# Altium schematic sheet USB INTERFACES.SchDoc
size A1; Organization: Protel International P/L; Address1: L3, 12a Rodborough Rd; Address2: Frenchs Forest; Address3: NSW; Address4: Australia 2086
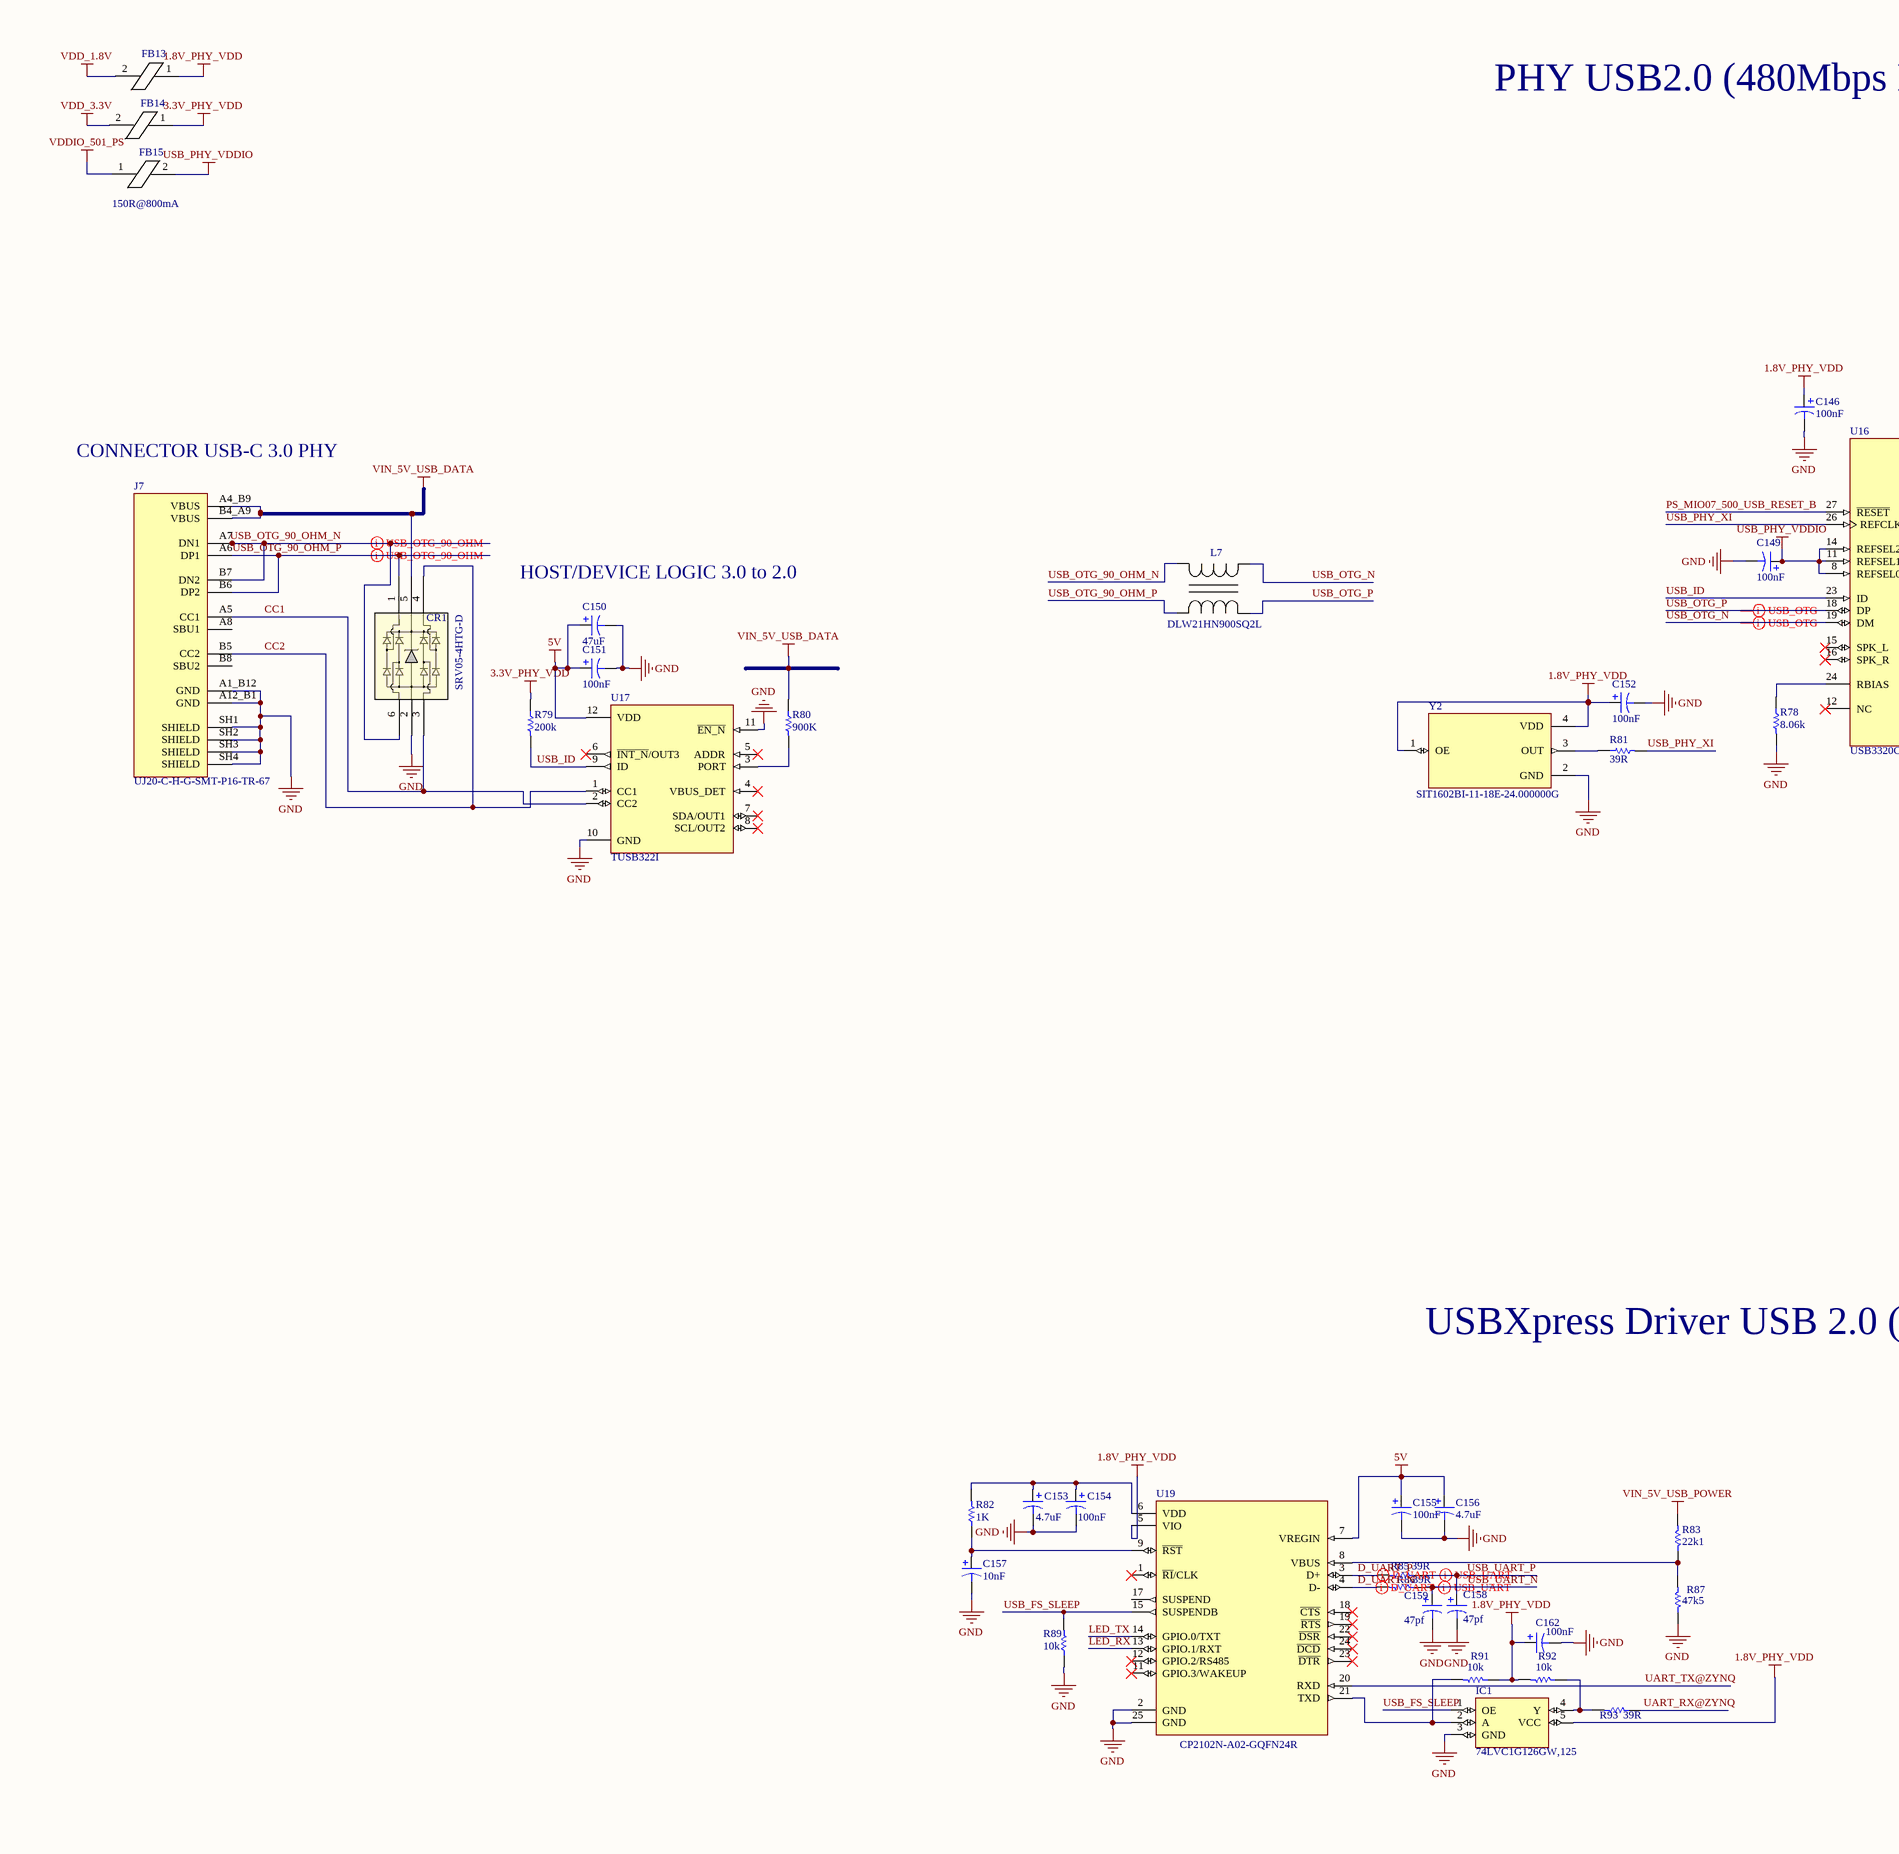
[diagram p0: USB INTERFACES.SchDoc, left]
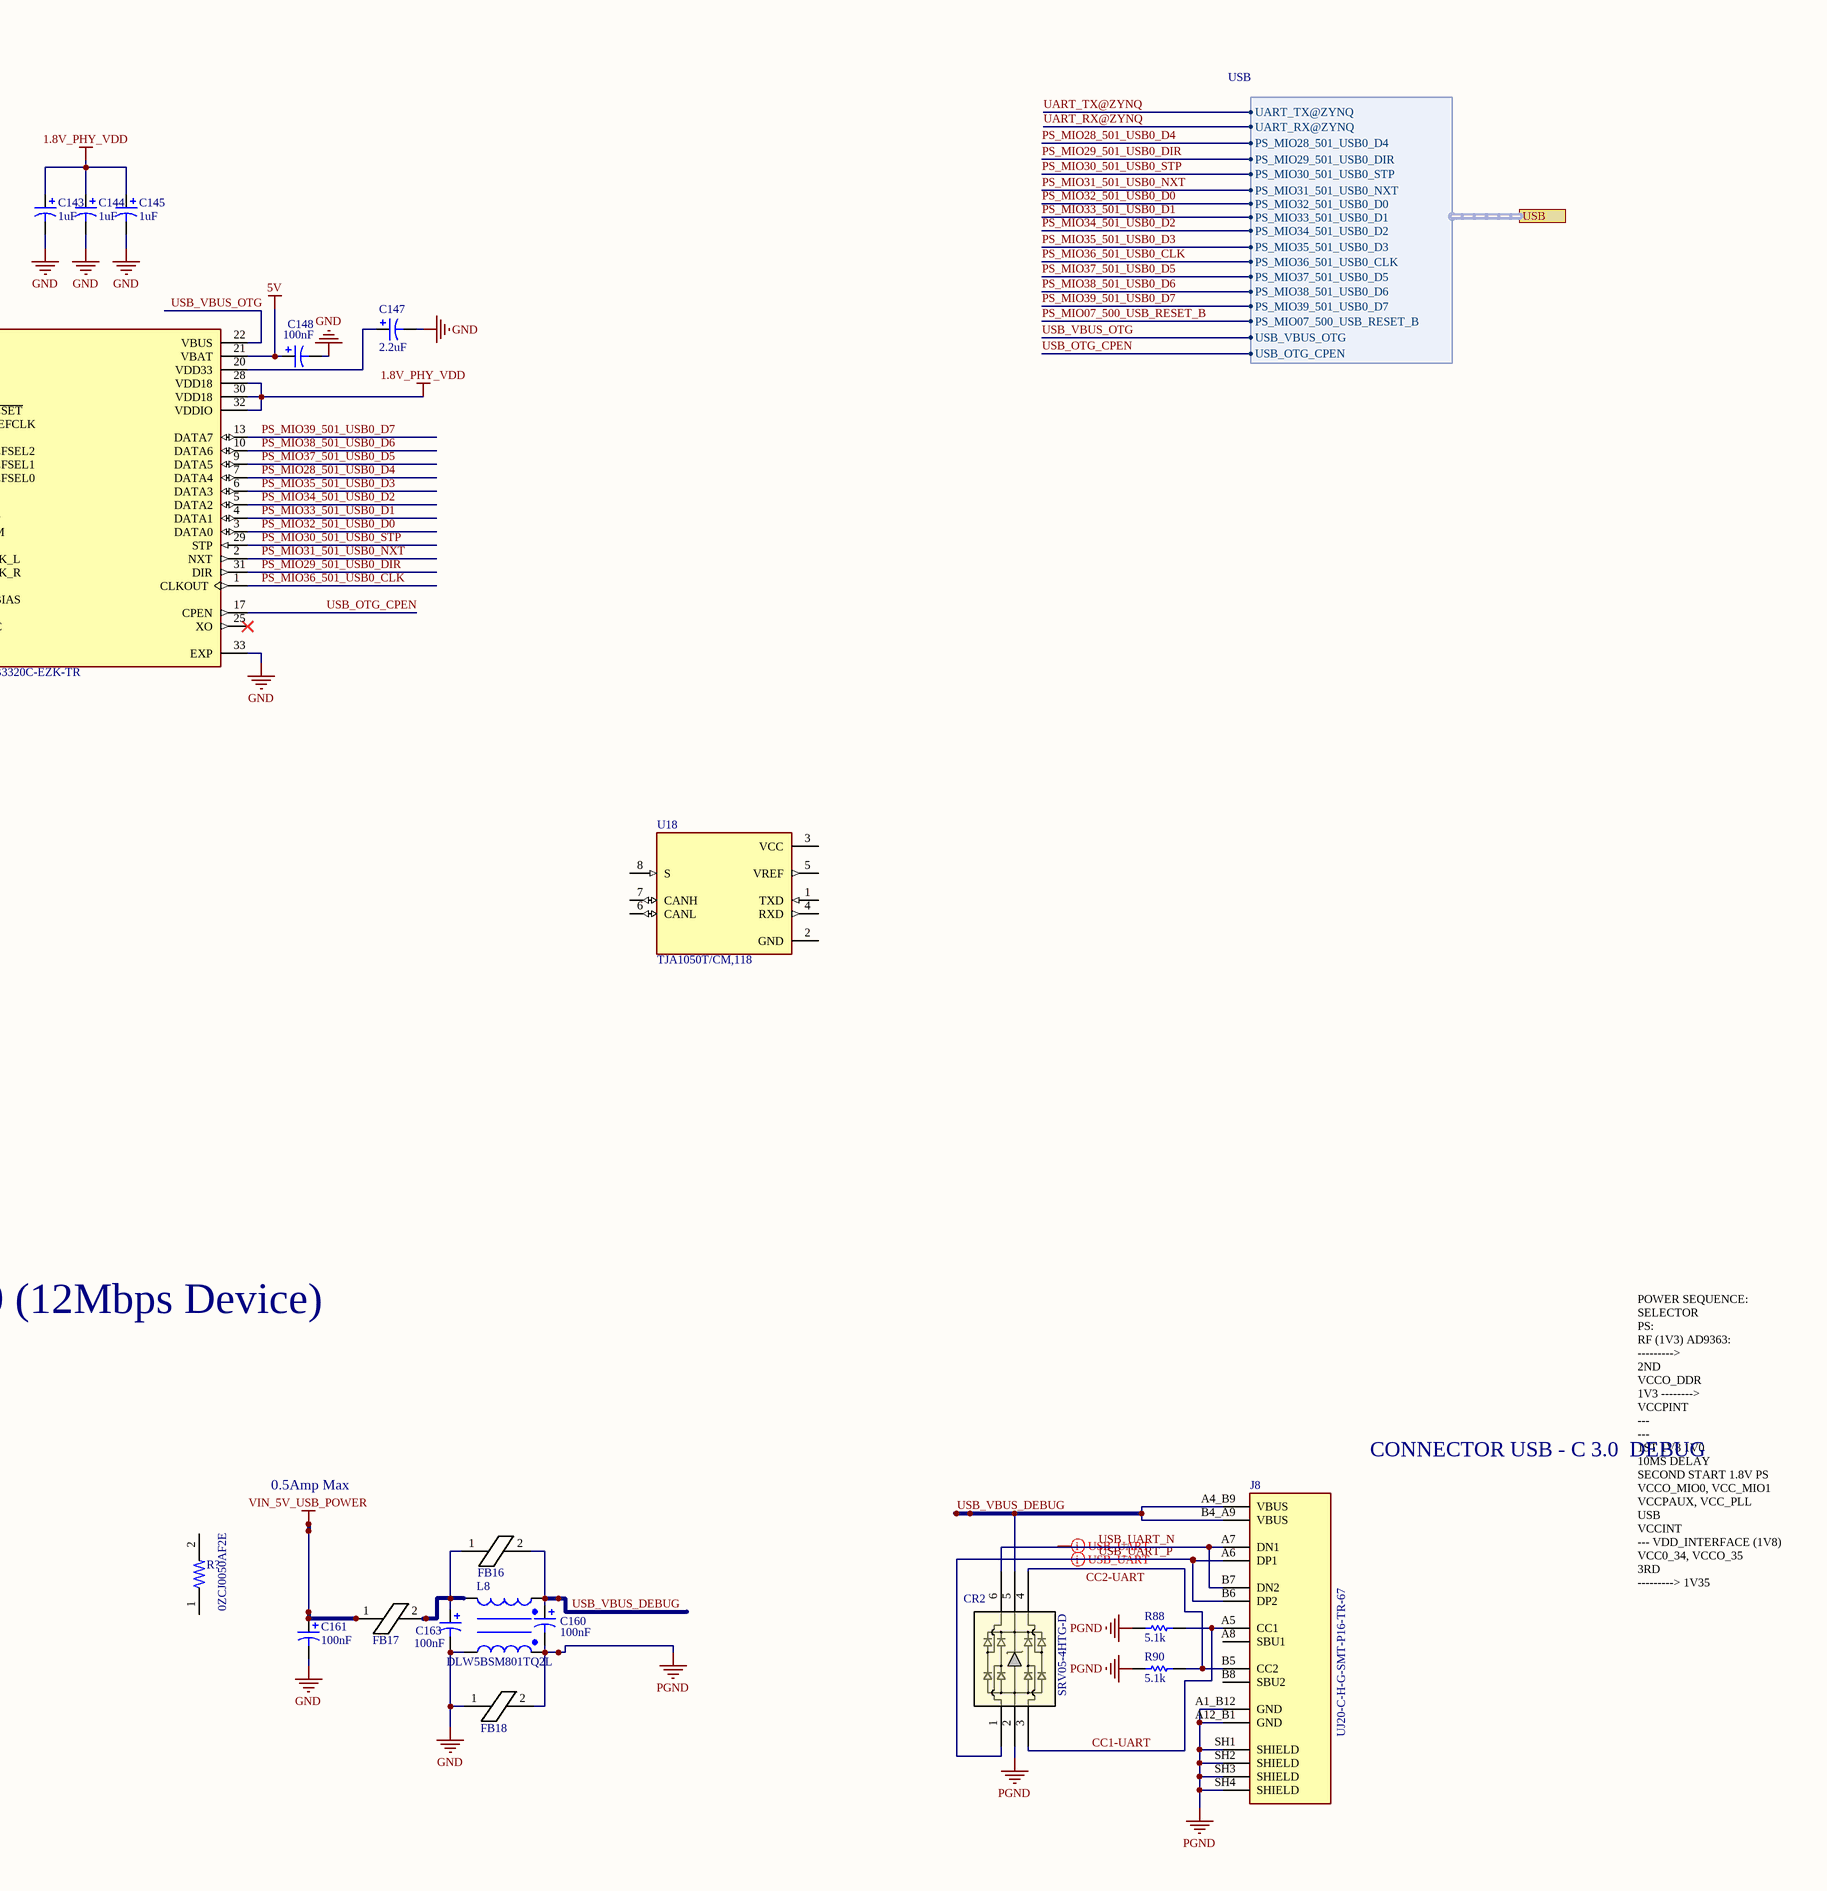
[diagram p1: USB INTERFACES.SchDoc, right]

## Parts
C143  value 1uF  [C0805]  (hidden comment: Cap Pol3)
C144  value 1uF  [C0805]  (hidden comment: Cap Pol3)
C145  value 1uF  [C0805]  (hidden comment: Cap Pol3)
C146  value 100nF  [C0805]  (hidden comment: Cap Pol3)
C147  value 2.2uF  [C0805]  (hidden comment: Cap Pol3)
C148  value 100nF  [C0805]  (hidden comment: Cap Pol3)
C149  value 100nF  [C0805]  (hidden comment: Cap Pol3)
C150  value 47uF  [C0805]  (hidden comment: Cap Pol3)
C151  value 100nF  [C0805]  (hidden comment: Cap Pol3)
C152  value 100nF  [C0805]  (hidden comment: Cap Pol3)
C153  value 4.7uF  [C0805]  (hidden comment: Cap Pol3)
C154  value 100nF  [C0805]  (hidden comment: Cap Pol3)
C155  value 100nF  [C0805]  (hidden comment: Cap Pol3)
C156  value 4.7uF  [C0805]  (hidden comment: Cap Pol3)
C157  value 10nF  [C0805]  (hidden comment: Cap Pol3)
C158  value 47pf  [C0805]  (hidden comment: Cap Pol3)
C159  value 47pf  [C0805]  (hidden comment: Cap Pol3)
C160  value 100nF  [C0805]  (hidden comment: Cap Pol3)
C161  value 100nF  [C0805]  (hidden comment: Cap Pol3)
C162  value 100nF  [C0805]  (hidden comment: Cap Pol3)
C163  value 100nF  [C0805]  (hidden comment: Cap Pol3)
CR1  SRV05-4HTG-D  [SOIC6_SOT23-6_CRA_LTF]
CR2  SRV05-4HTG-D  [SOIC6_SOT23-6_CRA_LTF]
FB13  FERRITA  [0805R]  (value not drawn)
FB14  FERRITA  [0805R]  (value not drawn)
FB15  FERRITA  [0805R]  (value not drawn)
FB16  FERRITA  [0805R]  (value not drawn)
FB17  FERRITA  [0805R]  (value not drawn)
FB18  FERRITA  [0805R]  (value not drawn)
IC1  74LVC1G126GW,125  [SOT65P212X110-5N]
J7  UJ20-C-H-G-SMT-P16-TR-67  [SAMESKY_UJ20-C-H-G-SMT-P16-TR-67]
J8  UJ20-C-H-G-SMT-P16-TR-67  [SAMESKY_UJ20-C-H-G-SMT-P16-TR-67]
L7  DLW21HN900SQ2L  [IND_DLW21H_0805_MUR]
L8  DLW5BSM801TQ2L  [FIL_DLW5BSM801TQ2L]
R78  value 8.06k  [0603]  (hidden comment: Res1)
R79  value 200k  [0603]  (hidden comment: Res1)
R80  value 900K  [0603]  (hidden comment: Res1)
R81  value 39R  [0603]  (hidden comment: Res1)
R82  value 1K  [0603]  (hidden comment: Res1)
R83  value 22k1  [0603]  (hidden comment: Res1)
R85  value 39R  [0603]  (hidden comment: Res1)
R86  value 39R  [0603]  (hidden comment: Res1)
R87  value 47k5  [0603]  (hidden comment: Res1)
R88  value 5.1k  [0603]  (hidden comment: Res1)
R89  value 10k  [0603]  (hidden comment: Res1)
R90  value 5.1k  [0603]  (hidden comment: Res1)
R91  value 10k  [0603]  (hidden comment: Res1)
R92  value 10k  [0603]  (hidden comment: Res1)
R93  value 39R  [0603]  (hidden comment: Res1)
R?  0ZCJ0050AF2E  [RESC3216X125N]
U16  USB3320C-EZK-TR  [QFN50P500X500X100-33N]
U17  TUSB322I  [IC_TUSB320IRWBR]
U18  TJA1050T/CM,118  [SOIC127P600X175-8N]
U19  CP2102N-A02-GQFN24R  [QFN50P400X400X80-25N]
Y2  SIT1602BI-11-18E-24.000000G  [OSC_SIT1602BI-11-18E-24.000000G]

## Ports
USB (harness USB)

## Harnesses
USB: PS_MIO29_501_USB0_DIR, PS_MIO28_501_USB0_D4, PS_MIO30_501_USB0_STP, PS_MIO31_501_USB0_NXT, PS_MIO33_501_USB0_D1, PS_MIO32_501_USB0_D0, PS_MIO34_501_USB0_D2, PS_MIO35_501_USB0_D3, PS_MIO37_501_USB0_D5, PS_MIO36_501_USB0_CLK, PS_MIO38_501_USB0_D6, PS_MIO39_501_USB0_D7, PS_MIO07_500_USB_RESET_B, USB_VBUS_OTG, USB_OTG_CPEN, UART_RX@ZYNQ, UART_TX@ZYNQ

## Nets
1.8V_PHY_VDD: C143.1 C144.1 C145.1 C146.1 C152.1 C162.1 FB13.1 IC1.5(VCC) R91.1 R92.2 U16.28(VDD18) U16.30(VDD18) U16.32(VDDIO) U19.5(VIO) Y2.1(OE) Y2.4(VDD)
3.3V_PHY_VDD: FB14.1 R79.1
5V: C148.1 C150.1 C151.1 C155.1 C156.1 U16.21(VBAT) U17.12(VDD) U19.7(VREGIN)
GND: C143.2 C144.2 C145.2 C146.2 C147.2 C148.2 C149.2 C150.2 C151.2 C152.2 C153.2 C154.2 C155.2 C156.2 C157.2 C158.2 C159.2 C161.2 C162.2 C163.2 CR1.2 FB18.1 IC1.3(GND) J7.A1_B12(GND) J7.A12_B1(GND) J7.SH1(SHIELD) J7.SH2(SHIELD) J7.SH3(SHIELD) J7.SH4(SHIELD) L8.3 R78.2 R87.1 R89.1 U16.33(EXP) U17.10(GND) U17.11(~{EN_N}) U19.2(GND) U19.25(GND) Y2.2(GND)
PGND: C160.2 CR2.2 FB18.2 J8.A1_B12(GND) J8.A12_B1(GND) J8.SH1(SHIELD) J8.SH2(SHIELD) J8.SH3(SHIELD) J8.SH4(SHIELD) L8.4 R88.1 R90.1
USB_PHY_VDDIO: C149.1 FB15.2 U16.8(REFSEL0) U16.11(REFSEL1) U16.14(REFSEL2)
VDD_1.8V: FB13.2
VDD_3.3V: FB14.2
VDDIO_501_PS: FB15.1
VIN_5V_USB_DATA: CR1.5 J7.A4_B9(VBUS) J7.B4_A9(VBUS) R80.1
VIN_5V_USB_POWER: C161.1 FB17.1 R83.2
CC1: CR1.3 J7.A5(CC1) U17.2(CC2)
CC1-UART: CR2.3 J8.A5(CC1) R88.2
CC2: CR1.4 J7.B5(CC2) U17.1(CC1)
CC2-UART: CR2.4 J8.B5(CC2) R90.2
D_UART_N: R86.2 U19.4(D-)
D_UART_P: R85.2 U19.3(D+)
LED_RX: U19.13(GPIO.1/RXT)
LED_TX: U19.14(GPIO.0/TXT)
PS_MIO07_500_USB_RESET_B: U16.27(~{RESET}) ; port USB.PS_MIO07_500_USB_RESET_B
PS_MIO28_501_USB0_D4: U16.7(DATA4) ; port USB.PS_MIO28_501_USB0_D4
PS_MIO29_501_USB0_DIR: U16.31(DIR) ; port USB.PS_MIO29_501_USB0_DIR
PS_MIO30_501_USB0_STP: U16.29(STP) ; port USB.PS_MIO30_501_USB0_STP
PS_MIO31_501_USB0_NXT: U16.2(NXT) ; port USB.PS_MIO31_501_USB0_NXT
PS_MIO32_501_USB0_D0: U16.3(DATA0) ; port USB.PS_MIO32_501_USB0_D0
PS_MIO33_501_USB0_D1: U16.4(DATA1) ; port USB.PS_MIO33_501_USB0_D1
PS_MIO34_501_USB0_D2: U16.5(DATA2) ; port USB.PS_MIO34_501_USB0_D2
PS_MIO35_501_USB0_D3: U16.6(DATA3) ; port USB.PS_MIO35_501_USB0_D3
PS_MIO36_501_USB0_CLK: U16.1(CLKOUT) ; port USB.PS_MIO36_501_USB0_CLK
PS_MIO37_501_USB0_D5: U16.9(DATA5) ; port USB.PS_MIO37_501_USB0_D5
PS_MIO38_501_USB0_D6: U16.10(DATA6) ; port USB.PS_MIO38_501_USB0_D6
PS_MIO39_501_USB0_D7: U16.13(DATA7) ; port USB.PS_MIO39_501_USB0_D7
UART_RX@ZYNQ: R93.1 ; port USB.UART_RX@ZYNQ
UART_TX@ZYNQ: U19.20(RXD) ; port USB.UART_TX@ZYNQ
USB_FS_SLEEP: IC1.1(OE) R89.2 U19.15(SUSPENDB)
USB_ID: R79.2 U16.23(ID) U17.9(ID)
USB_OTG_90_OHM_N: CR1.6 J7.A7(DN1) J7.B7(DN2) L7.1
USB_OTG_90_OHM_P: CR1.1 J7.A6(DP1) J7.B6(DP2) L7.4
USB_OTG_CPEN: U16.17(CPEN) ; port USB.USB_OTG_CPEN
USB_OTG_N: L7.2 U16.19(DM)
USB_OTG_P: L7.3 U16.18(DP)
USB_PHY_XI: R81.2 U16.26(REFCLK)
USB_UART_N: C159.1 CR2.6 J8.A7(DN1) J8.B7(DN2) R86.1
USB_UART_P: C158.1 CR2.1 J8.A6(DP1) J8.B6(DP2) R85.1
USB_VBUS_DEBUG: C160.1 CR2.5 FB16.2 J8.A4_B9(VBUS) J8.B4_A9(VBUS) L8.1
USB_VBUS_OTG: U16.22(VBUS) ; port USB.USB_VBUS_OTG
NetC147_1: C147.1 U16.20(VDD33)
NetC153_1: C153.1 C154.1 R82.2 U19.6(VDD)
NetC157_1: C157.1 R82.1 U19.9(~{RST})
NetC163_1: C163.1 FB16.1 FB17.2 L8.2
NetIC1_2: IC1.2(A) R91.2 U19.21(TXD)
NetIC1_4: IC1.4(Y) R92.1 R93.2
NetR78_1: R78.1 U16.24(RBIAS)
NetR80_2: R80.2 U17.3(PORT)
NetR81_1: R81.1 Y2.3(OUT)
NetR83_1: R83.1 R87.2 U19.8(VBUS)

Not connected (* = marked no-connect by the designer): J7 A8(SBU1) B8(SBU2); J8 A8(SBU1) B8(SBU2); R? 1 2; U16 12(NC)* 15(SPK_L)* 16(SPK_R)* 25(XO)*; U17 4(VBUS_DET)* 5(ADDR)* 6(~{INT_N}/OUT3)* 7(SDA/OUT1)* 8(SCL/OUT2)*; U18 1(TXD) 2(GND) 3(VCC) 4(RXD) 5(VREF) 6(CANL) 7(CANH) 8(S); U19 1(~{RI}/CLK)* 11(GPIO.3/WAKEUP)* 12(GPIO.2/RS485)* 17(SUSPEND) 18(~{CTS})* 19(~{RTS})* 22(~{DSR})* 23(~{DTR})* 24(~{DCD})*

## Layout directives
differential pair: (no net found under the mark), D_UART_N, D_UART_P, USB_OTG_90_OHM_N, USB_OTG_90_OHM_P, USB_OTG_N, USB_OTG_P, USB_UART_N, USB_UART_P

## Notes on the sheet
- PHY USB2.0 (480Mbps Host - Device)
- (near FB15) 150R@800mA
- (near J7) CONNECTOR USB-C 3.0 PHY
- (near C150) HOST/DEVICE LOGIC 3.0 to 2.0
- USBXpress Driver USB 2.0 (12Mbps Device)
- 0.5Amp Max
- (near J8) CONNECTOR USB - C 3.0  DEBUG
- POWER SEQUENCE:
  SELECTOR
  PS:
  RF (1V3) AD9363:
  --------->
  2ND
  VCCO_DDR
  1V3 -------->
  VCCPINT
  ---
  ---
  1ST 1V8 1V0
  10MS DELAY
  SECOND START 1.8V PS
  VCCO_MIO0, VCC_MIO1
  VCCPAUX, VCC_PLL
  USB
  VCCINT
  --- VDD_INTERFACE (1V8)
  VCC0_34, VCCO_35
  3RD
  ---------> 1V35
- Title
- Size:
- Date:
- File:
- A1
- Number:
- Time:
- Revision:
- Sheet
- of

## Library data of the parts
C143-C163 = Cap Pol3: Polarized Capacitor (Surface Mount); Published: 8-Jun-2000; LatestRevisionDate: 29-May-2009; LatestRevisionNote: IPC-7351 Footprint Added.; PackageReference: C0805; Publisher: Altium Limited; PackageDescription: Chip Capacitor
CR1 CR2 = SRV05-4HTG-D: No Description Available; Mfr_Name: Littelfuse Inc; RefDes: RefDes; Type: Type
IC1 = 74LVC1G126GW,125: Buffer, Non-Inverting 1 Element 1 Bit per Element 3-State Output 5-TSSOP; MF: Nexperia USA Inc.; SnapEDA_Link: https://www.snapeda.com/parts/74LVC1G126GW,125/Nexperia/view-part/?ref=snap; Package: None; Value: *; MP: 74LVC1G126GW,125; Check_prices: https://www.snapeda.com/parts/74LVC1G126GW,125/Nexperia/view-part/?ref=eda
L7 = DLW21HN900SQ2L: No Description Available; Mfr_Name: Murata
L8 = DLW5BSM801TQ2L: 2 Line Common Mode Choke Surface Mount 800 Ohms @ 100MHz 2A DCR 56mOhm; MF: Murata; Value: *; SnapEDA_Link: https://www.snapeda.com/parts/DLW5BSM801TQ2L/Murata/view-part/4300902/?ref=snap; MP: DLW5BSM801TQ2L; Package: Horizontal-4 Murata; DigiKey-Purchase-URL: https://snapeda.com/shop?store=DigiKey&id=4300902; Digi-Key_Part_Number: 490-9569-1-ND
R78-R83 R85-R93 = Res1_1: Resistor; Manufacturer: Generic Components; Class I: Passive; Published: 8-Jun-2000; Revision: July-2002: Re-released for DXP Platform.; Publisher: Altium Limited; Class II: Resistor; REF FARNELL 1206 SMD 510R: 4387065; REF FARNELL 1206 SMD 1K: 912475; REF FARNELL 1206 SMD 10K: 912591; REF FARNELL 0603 SMD: 612-595
R? = 0ZCJ0050AF2E: 1206 SMT PPTC | 0.50 Ih | 24V; MF: Bel Fuse; Availability: Unavailable; Price: None; Package: 1206 Bel Fuse; MP: 0ZCJ0050AF2E; Value: *; SnapEDA_Link: https://www.snapeda.com/parts/0ZCJ0050AF2E/Bel%20Fuse%20Inc./view-part/1301170/?ref=snap
U16 = USB3320C-EZK-TR: Microchip USB3320C-EZK-TR, USB Transceiver, USB 2.0, 1.8 V, 3.3 V, 32-Pin QFN | Microchip Technology Inc. USB3320C-EZK-TR; SnapEDA_Link: https://www.snapeda.com/parts/USB3320C-EZK-TR/Microchip/view-part/?ref=snap; Package: QFN-32 Microchip; Value: *; MF: Microchip; MP: USB3320C-EZK-TR; Check_prices: https://www.snapeda.com/parts/USB3320C-EZK-TR/Microchip/view-part/?ref=eda
U17 = TUSB320IRWBR: USB Type-C configuration channel logic and port control; MF: Texas Instruments; SnapEDA_Link: https://www.snapeda.com/parts/TUSB320IRWBR/Texas+Instruments/view-part/?ref=snap; Package: X2QFN-12 Texas Instruments; Value: *; MP: TUSB320IRWBR; Check_prices: https://www.snapeda.com/parts/TUSB320IRWBR/Texas+Instruments/view-part/?ref=eda
U18 = TJA1050T/CM,118: 1/1 Transceiver Half CANbus 8-SO; MF: NXP USA; SnapEDA_Link: https://www.snapeda.com/parts/TJA1050T/CM,118/NXP%20USA%20Inc./view-part/304529/?ref=snap; Value: *; Purchase-URL: https://pricing.snapeda.com/search/part/TJA1050T/CM,118/?ref=eda; Check_prices: https://www.snapeda.com/parts/TJA1050T/CM,118/NXP%20USA%20Inc./view-part/304529/?ref=eda; Price: None; Availability: In Stock; MP: TJA1050T/CM,118; Package: SO-8 NXP Semiconductors
Y2 = SIT1602BI-11-18E-24.000000G: Oscillator MEMS 24MHz Â±20ppm (Stability) 15pF HCMOS/LVCMOS 55% 1.8V 4-Pin PQFN SMD T/R; MF: SiTime; SnapEDA_Link: https://www.snapeda.com/parts/SIT1602BI-11-18E-24.000000G/SiTime/view-part/?ref=snap; Package: None; Value: *; MP: SIT1602BI-11-18E-24.000000G; Check_prices: https://www.snapeda.com/parts/SIT1602BI-11-18E-24.000000G/SiTime/view-part/?ref=eda
FB13-FB18 = FERRITA: CODIGO DIGIKEY: *; CODIGO FARNELL: *; CODIGO MOUSER: *; CODIGO PRODUCTO: *; DISTRIBUIDOR 1: *; DISTRIBUIDOR 2: *
J7 J8 = UJ20-C-H-G-SMT-P16-TR-67: Package: None; Price: None; Value: *; MP: UJ20-C-H-G-SMT-P16-TR-67; Availability: Unavailable
U19 = CP2102N-A02-GQFN24R: Value: *; MP: CP2102N-A02-GQFN24R; Package: None; Availability: Unavailable; Price: None